# Altium schematic sheet V2_P1.schdoc
size 518 x 314 mm; Symbol: Sheet-Symbol_A4; Device: Sheet-Symbol_A4; @Project Name: rovi-controller; @Page Count: 1; @Update Date: 2024-12-15; @Create Date: 2024-11-28; @Schematic Name: Schematic2; @Page No: 1; @Page Name: P1; Company: EasyEDA.com; Reviewed: EasyEDA; Version: V0.1; Page Size: A4; Part Number: JLCPCB-002; Drawn: EasyEDA; @Board Name: Board2; @Create Time: 08:21:59; @Update Time: 13:14:34; Width: 2000; Height: 1200; Region Start: 1; X Region Count: 6; Y Region Count: 4; Blade Width: 10; Title Block Position: 3
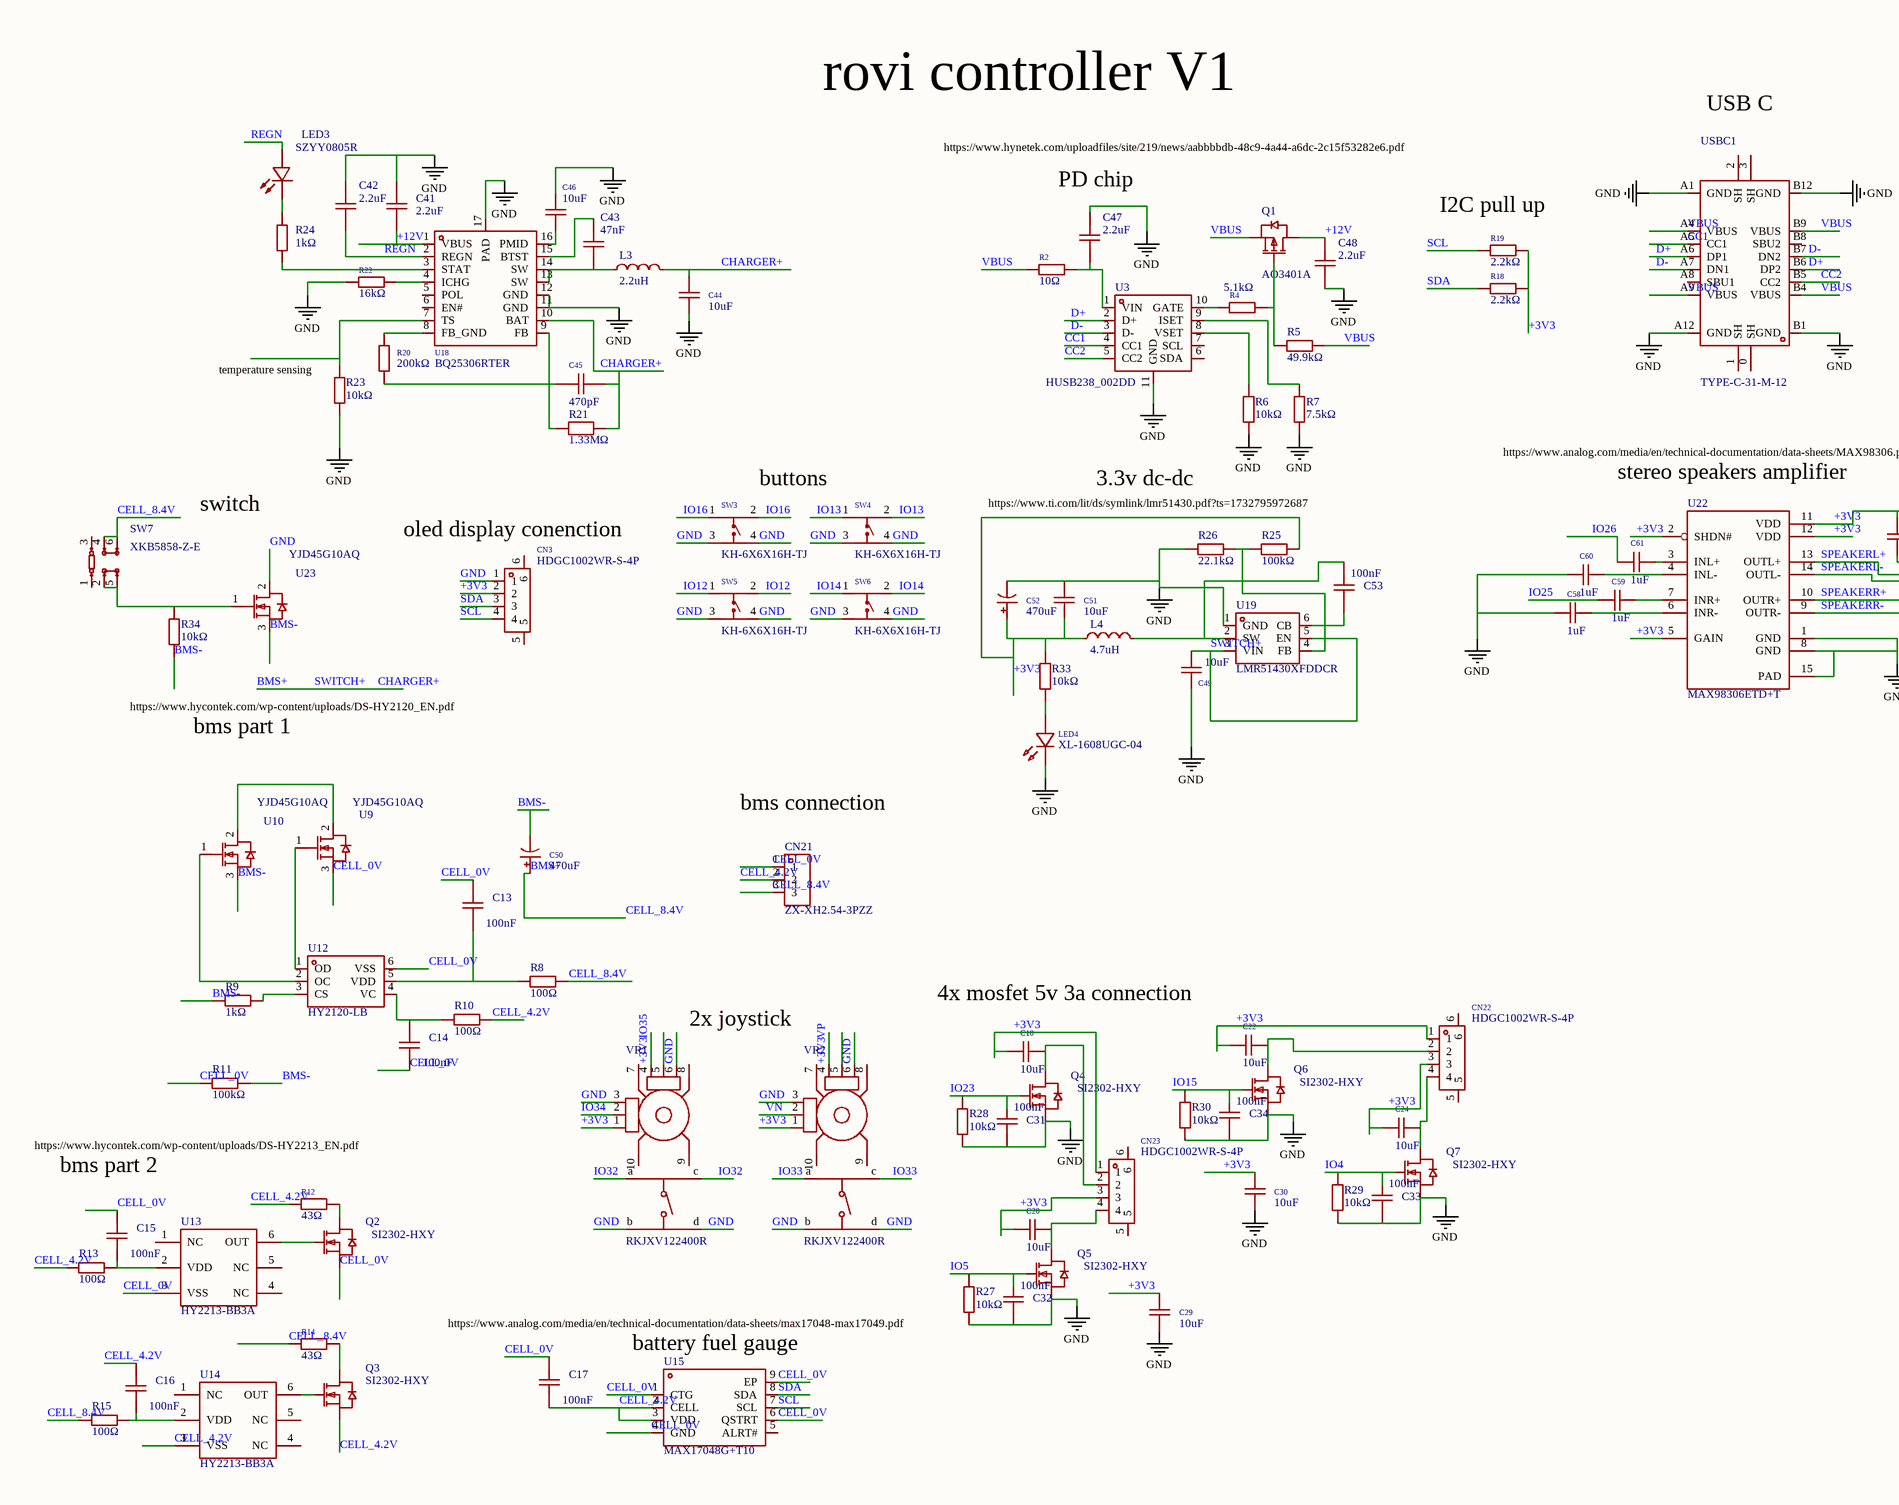
[diagram p0: V2_P1.schdoc, left]
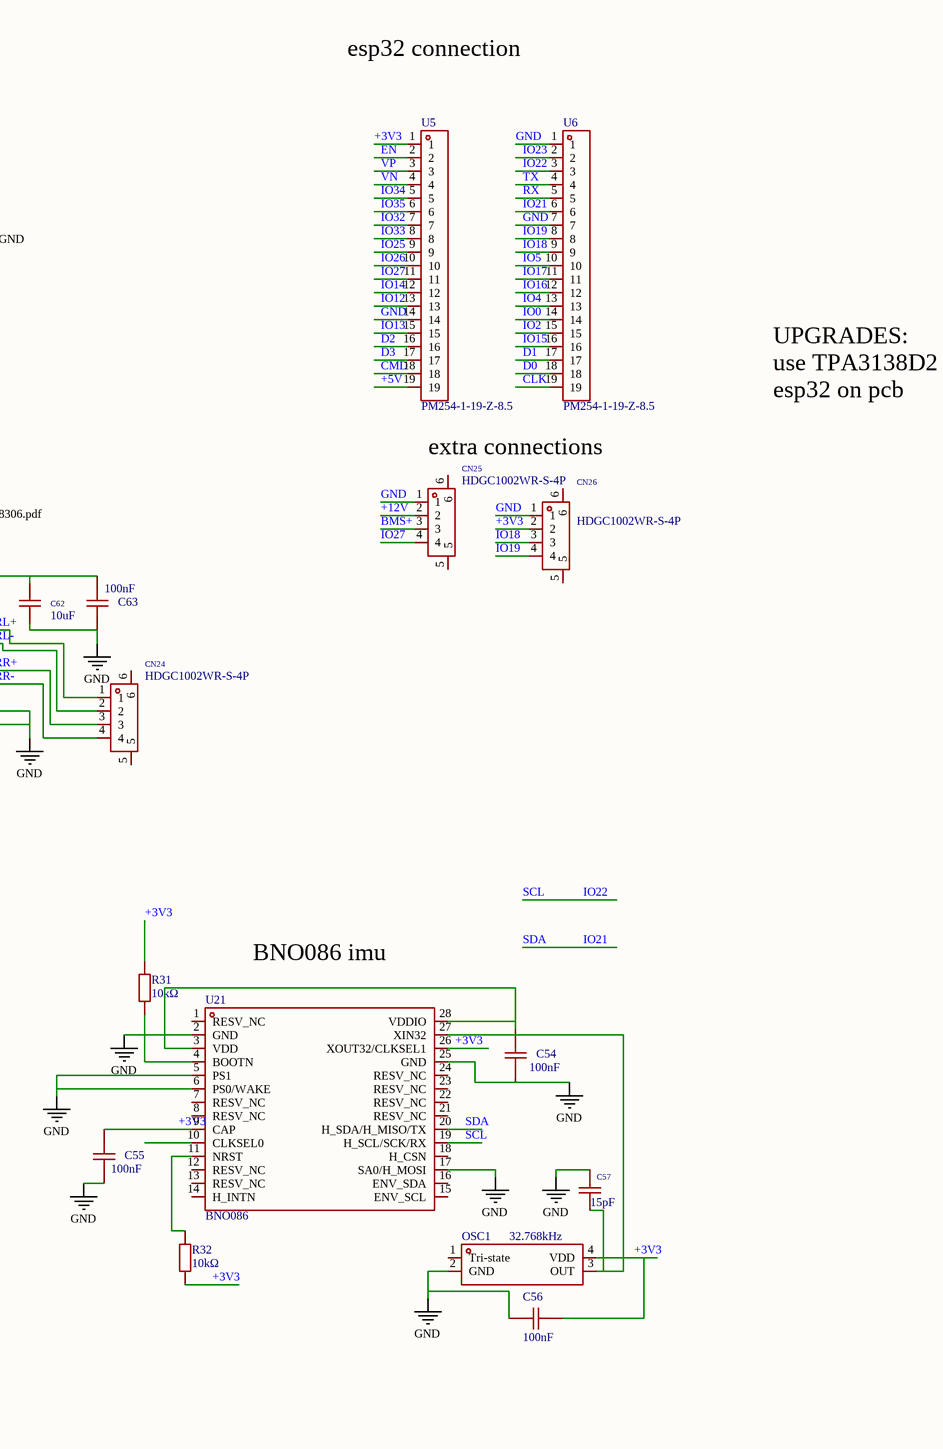
[diagram p1: V2_P1.schdoc, right]

## Parts
C13  100nF  [C0402]
C14  100nF  [C0402]
C15  100nF  [C0402]
C16  100nF  [C0402]
C17  100nF  [C0402]
C18  10uF  [C0805]
C20  10uF  [C0805]
C22  10uF  [C0805]
C24  10uF  [C0805]
C29  10uF  [C0805]
C30  10uF  [C0805]
C31  100nF  [C0402]
C32  100nF  [C0402]
C33  100nF  [C0402]
C34  100nF  [C0402]
C41  2.2uF  [C0603]
C42  2.2uF  [C0603]
C43  47nF  [C0402]
C44  10uF  [C0805]
C45  470pF  [C0402]
C46  10uF  [C0805]
C47  2.2uF  [C0603]
C48  2.2uF  [C0603]
C49  10uF  [C0805]
C50  470uF  [CAP-TH_BD8.0-P3.50-D0.6-FD]
C51  10uF  [C0805]
C52  470uF  [CAP-TH_BD8.0-P3.50-D0.6-FD]
C53  100nF  [C0402]
C54  100nF  [C0402]
C55  100nF  [C0402]
C56  100nF  [C0402]
C57  15pF  [C0402]
C58  1uF  [C0402]
C59  1uF  [C0402]
C60  1uF  [C0402]
C61  1uF  [C0402]
C62  10uF  [C0805]
C63  100nF  [C0402]
CN3  HDGC1002WR-S-4P  [CONN-SMD_4P-P1.00_HDGC_HDGC1002WR-S-4P]
CN21  ZX-XH2.54-3PZZ  [CONN-TH_3P-P2.54_2501S-3P]
CN22  HDGC1002WR-S-4P  [CONN-SMD_4P-P1.00_HDGC_HDGC1002WR-S-4P]
CN23  HDGC1002WR-S-4P  [CONN-SMD_4P-P1.00_HDGC_HDGC1002WR-S-4P]
CN24  HDGC1002WR-S-4P  [CONN-SMD_4P-P1.00_HDGC_HDGC1002WR-S-4P]
CN25  HDGC1002WR-S-4P  [CONN-SMD_4P-P1.00_HDGC_HDGC1002WR-S-4P]
CN26  HDGC1002WR-S-4P  [CONN-SMD_4P-P1.00_HDGC_HDGC1002WR-S-4P]
L3  2.2uH  [IND-SMD_L4.4-W4.2]
L4  4.7uH  [IND-SMD_L5.4-W5.2_FXL0530]
LED3  SZYY0805R  [LED0805-R-RD]
LED4  XL-1608UGC-04  [LED0603-RD_GREEN]
OSC1  32.768kHz  [OSC-SMD_4P-L3.2-W2.5-BL_TG-5006CE]
Q1  AO3401A  [SOT-23_L2.9-W1.3-P1.90-LS2.4-BR]
Q2  SI2302-HXY  [SOT-23-3_L2.9-W1.3-P1.90-LS2.4-BR]
Q3  SI2302-HXY  [SOT-23-3_L2.9-W1.3-P1.90-LS2.4-BR]
Q4  SI2302-HXY  [SOT-23-3_L2.9-W1.3-P1.90-LS2.4-BR]
Q5  SI2302-HXY  [SOT-23-3_L2.9-W1.3-P1.90-LS2.4-BR]
Q6  SI2302-HXY  [SOT-23-3_L2.9-W1.3-P1.90-LS2.4-BR]
Q7  SI2302-HXY  [SOT-23-3_L2.9-W1.3-P1.90-LS2.4-BR]
R2  10Ω  [R0402]
R4  5.1kΩ  [R0402]
R5  49.9kΩ  [R0402]
R6  10kΩ  [R0402]
R7  7.5kΩ  [R0402]
R8  100Ω  [R0603]
R9  1kΩ  [R0603]
R10  100Ω  [R0603]
R11  100kΩ  [R0603]
R12  43Ω  [R2512]
R13  100Ω  [R0603]
R14  43Ω  [R2512]
R15  100Ω  [R0603]
R18  2.2kΩ  [R0402]
R19  2.2kΩ  [R0402]
R20  200kΩ  [R0402]
R21  1.33MΩ  [R0402]
R22  16kΩ  [R0402]
R23  10kΩ  [R0402]
R24  1kΩ  [R0805]
R25  100kΩ  [R0603]
R26  22.1kΩ  [R0402]
R27  10kΩ  [R0402]
R28  10kΩ  [R0402]
R29  10kΩ  [R0402]
R30  10kΩ  [R0402]
R31  10kΩ  [R0402]
R32  10kΩ  [R0402]
R33  10kΩ  [R0402]
R34  10kΩ  [R0402]
SW3  KH-6X6X16H-TJ  [SW-TH_4P-L6.0-W6.0-P4.50-LS6.5]
SW4  KH-6X6X16H-TJ  [SW-TH_4P-L6.0-W6.0-P4.50-LS6.5]
SW5  KH-6X6X16H-TJ  [SW-TH_4P-L6.0-W6.0-P4.50-LS6.5]
SW6  KH-6X6X16H-TJ  [SW-TH_4P-L6.0-W6.0-P4.50-LS6.5]
SW7  XKB5858-Z-E  [SW-TH_XKB5858-Z-E]
U3  HUSB238_002DD  [DFN-10_L3.0-W3.0-P0.50-BL-EP2.5]
U5  PM254-1-19-Z-8.5  [HDR-TH_19P-P2.54-V-F]
U6  PM254-1-19-Z-8.5  [HDR-TH_19P-P2.54-V-F]
U9  YJD45G10AQ  [TO-252-2_L6.6-W6.1-P4.57-LS10.1-BR-CW]
U10  YJD45G10AQ  [TO-252-2_L6.6-W6.1-P4.57-LS10.1-BR-CW]
U12  HY2120-LB  [SOT-23-6_L2.9-W1.6-P0.95-LS2.8-BR]
U13  HY2213-BB3A  [SOT-23-6_L2.9-W1.6-P0.95-LS2.8-BR]
U14  HY2213-BB3A  [SOT-23-6_L2.9-W1.6-P0.95-LS2.8-BR]
U15  MAX17048G+T10  [DFN-8_L2.0-W2.0-P0.50-BL-EP]
U18  BQ25306RTER  [TQFN-16_L3.0-W3.0-P0.50-BL-EP1.7]
U19  LMR51430XFDDCR  [TSOT-23-6_L2.9-W1.6-P0.95-LS2.8-TL]
U21  BNO086  [LGA-28_L5.2-W3.8-P0.50-BL]
U22  MAX98306ETD+T  [TDFN-14_L3.0-W3.0-P0.40-BL-EP]
U23  YJD45G10AQ  [TO-252-2_L6.6-W6.1-P4.57-LS10.1-BR-CW]
USBC1  TYPE-C-31-M-12  [USB-C_SMD-TYPE-C-31-M-12]
VR1  RKJXV122400R  [SW-TH_RKJXV1224005]
VR2  RKJXV122400R  [SW-TH_RKJXV1224005]

## Nets
GND: C29.2 C30.2 C31.1 C32.1 C33.1 C34.1 C41.2 C42.2 C44.2 C46.1 C47.2 C48.1 C49.1 C51.2 C52.2 C54.1 C55.1 C56.2 C57.2 C58.1 C60.1 C62.1 C63.1 CN3.1 CN25.1 CN26.1 LED4.1(K) OSC1.2(GND) Q4.2(S) Q5.2(S) Q6.2(S) Q7.2(S) R6.2 R7.1 R22.1 R23.2 R26.1 R27.2 R28.2 R29.2 R30.2 SW3.3 SW3.4 SW4.3 SW4.4 SW5.3 SW5.4 SW6.3 SW6.4 U3.11(GND) U5.14 U6.1 U6.7 U18.11(GND) U18.12(GND) U18.17(PAD) U19.1(GND) U21.2(GND) U21.5(PS1) U21.6(PS0/WAKE) U21.17(SA0/H_MOSI) U21.25(GND) U22.1(GND) U22.8(GND) U22.15(PAD) U23.2(D) USBC1.A1(GND) USBC1.A12(GND) USBC1.B1(GND) USBC1.B12(GND) VR1.3(A) VR1.6(B) VR1.b VR1.d VR2.3(A) VR2.6(B) VR2.b VR2.d
+3V3: C18.2 C20.2 C22.2 C24.2 C29.1 C30.1 C51.1 C52.1 C55.2 C56.1 C62.2 C63.2 CN3.2 CN22.1 CN22.3 CN23.1 CN23.3 CN26.2 L4.1 OSC1.4(VDD) R18.2 R19.2 R25.2 R31.1 R32.2 R33.1 U5.1 U5.3 U5.6 U21.9(CAP) U21.26(XOUT32/CLKSEL1) U22.2(SHDN#) U22.5(GAIN) U22.11(VDD) U22.12(VDD) VR1.1(B) VR1.4(A) VR2.1(B) VR2.4(A)  [also labelled IO35, VP]
+5V: U5.19
+12V: C41.1 C48.2 CN25.2 Q1.3(D) U18.1(VBUS)
BMS+: C44.1 C45.2 C49.2 C50.1 CN21.3 CN25.3 L3.2 R8.2 R14.1 R15.1 R21.2 SW7.4 SW7.6 U18.10(BAT) U19.3(VIN) U19.5(EN)  [also labelled CELL_8.4V, CHARGER+, SWITCH+]
BMS-: C50.2 R9.1 R11.2 R34.2 U10.3(S) U23.3(S)
CC1: U3.4(CC1) USBC1.A5(CC1)
CC2: U3.5(CC2) USBC1.B5(CC2)
CELL_0V: C13.2 C14.1 C15.2 C17.2 CN21.1 Q2.2(S) R11.1 U9.3(S) U12.6(VSS) U13.3(VSS) U15.1(CTG) U15.4(GND) U15.6(QSTRT) U15.9(EP)
CELL_4.2V: C16.2 C17.1 CN21.2 Q3.2(S) R10.2 R12.1 R13.1 U14.3(VSS) U15.2(CELL) U15.3(VDD)
CLK: U6.19
CMD: U5.18
D0: U6.18
D1: U6.17
D2: U5.16
D3: U5.17
D+: U3.2(D+) USBC1.A6(DP1) USBC1.B6(DP2)
D-: U3.3(D-) USBC1.A7(DN1) USBC1.B7(DN2)
EN: U5.2
IO0: U6.14
IO2: U6.15
IO4: C33.2 Q7.1(G) R29.1 U6.13
IO5: C32.2 Q5.1(G) R27.1 U6.10
IO12: SW5.1 SW5.2 U5.13
IO13: SW4.1 SW4.2 U5.15
IO14: SW6.1 SW6.2 U5.12
IO15: C34.2 Q6.1(G) R30.1 U6.16
IO16: SW3.1 SW3.2 U6.12
IO17: U6.11
IO18: CN26.3 U6.9
IO19: CN26.4 U6.8
IO21: CN3.3 R18.1 U6.6 U15.8(SDA) U21.20(H_SDA/H_MISO/TX)  [also labelled SDA]
IO22: CN3.4 R19.1 U6.3 U15.7(SCL) U21.19(H_SCL/SCK/RX)  [also labelled SCL]
IO23: C31.2 Q4.1(G) R28.1 U6.2
IO25: C59.1 U5.9
IO26: C61.1 U5.10
IO27: CN25.4 U5.11
IO32: U5.7 VR1.a VR1.c
IO33: U5.8 VR2.a VR2.c
IO34: U5.5 VR1.2(DTA)
REGN: C42.1 LED3.1(+) U18.2(REGN)
RX: U6.5
SPEAKERL+: CN24.1 U22.13(OUTL+)
SPEAKERL-: CN24.2 U22.14(OUTL-)
SPEAKERR+: CN24.3 U22.10(OUTR+)
SPEAKERR-: CN24.4 U22.9(OUTR-)
TX: U6.4
VBUS: Q1.2(S) R2.2 R5.1 USBC1.A4(VBUS) USBC1.A9(VBUS) USBC1.B4(VBUS) USBC1.B9(VBUS)
VN: U5.4 VR2.2(DTA)
NetC13_1: C13.1 R8.1 U12.5(VDD)
NetC14_2: C14.2 R10.1 U12.4(VC)
NetC15_1: C15.1 R13.2 U13.2(VDD)
NetC16_1: C16.1 R15.2 U14.2(VDD)
NetC18_1: C18.1 CN23.2 Q4.3(D)
NetC20_1: C20.1 CN23.4 Q5.3(D)
NetC22_1: C22.1 CN22.2 Q6.3(D)
NetC24_1: C24.1 CN22.4 Q7.3(D)
NetC43_1: C43.1 L3.1 U18.13(SW) U18.14(SW)
NetC43_2: C43.2 U18.15(BTST)
NetC45_1: C45.1 R20.1 R21.1 U18.9(FB)
NetC46_2: C46.2 U18.16(PMID)
NetC47_1: C47.1 R2.1 U3.1(VIN)
NetC53_1: C53.1 U19.6(CB)
NetC53_2: C53.2 L4.2 U19.2(SW)
NetC54_2: C54.2 U21.3(VDD) U21.28(VDDIO)
NetC57_1: C57.1 OSC1.3(OUT) U21.27(XIN32)
NetC58_2: C58.2 U22.6(INR-)
NetC59_2: C59.2 U22.7(INR+)
NetC60_2: C60.2 U22.4(INL-)
NetC61_2: C61.2 U22.3(INL+)
NetLED3_2: LED3.2(-) R24.2
NetLED4_2: LED4.2(A) R33.2
NetQ1_1: Q1.1(G) R4.1 R5.2
NetQ2_1: Q2.1(G) U13.6(OUT)
NetQ2_3: Q2.3(D) R12.2
NetQ3_1: Q3.1(G) U14.6(OUT)
NetQ3_3: Q3.3(D) R14.2
NetR4_2: R4.2 U3.10(GATE)
NetR6_1: R6.1 U3.8(VSET)
NetR7_2: R7.2 U3.9(ISET)
NetR9_2: R9.2 U12.3(CS)
NetR20_2: R20.2 U18.8(FB_GND)
NetR22_2: R22.2 U18.4(ICHG)
NetR23_1: R23.1 U18.7(TS)
NetR24_1: R24.1 U18.3(STAT)
NetR25_1: R25.1 R26.2 U19.4(FB)
NetR31_2: R31.2 U21.4(BOOTN)
NetR32_1: R32.1 U21.11(NRST)
NetR34_1: R34.1 SW7.2 SW7.5 U23.1(G)
NetU9_1: U9.1(G) U12.1(OD)
NetU9_2: U9.2(D) U10.2(D)
NetU10_1: U10.1(G) U12.2(OC)

Not connected (* = marked no-connect by the designer): CN3 5 6; CN22 5 6; CN23 5 6; CN24 5 6; CN25 5 6; CN26 5 6; OSC1 1(Tri-state); SW7 1 3; U3 6(SDA) 7(SCL); U13 1(NC) 4(NC) 5(NC); U14 1(NC) 4(NC) 5(NC); U15 5(ALRT#); U18 5(POL) 6(EN#); U21 1(RESV_NC) 7(RESV_NC) 8(RESV_NC) 10(CLKSEL0) 12(RESV_NC) 13(RESV_NC) 14(H_INTN) 15(ENV_SCL) 16(ENV_SDA) 18(H_CSN) 21(RESV_NC) 22(RESV_NC) 23(RESV_NC) 24(RESV_NC); USBC1 0(SH) 1(SH) 2(SH) 3(SH) A8(SBU1) B8(SBU2); VR1 5(DTA) 7(GND) 8(GND) 9(GND) 10(GND); VR2 5(DTA) 7(GND) 8(GND) 9(GND) 10(GND)

## Notes on the sheet
- esp32 connection
- rovi controller V1
- USB C
- https://www.hynetek.com/uploadfiles/site/219/news/aabbbbdb-48c9-4a44-a6dc-2c15f53282e6.pdf
- (near C47) PD chip
- (near R19) I2C pull up
- UPGRADES:
  use TPA3138D2 as audio
  esp32 on pcb
- (near R23) temperature sensing
- extra connections
- https://www.analog.com/media/en/technical-documentation/data-sheets/MAX98306.pdf
- switch
- buttons
- https://www.ti.com/lit/ds/symlink/lmr51430.pdf?ts=1732795972687
- 3.3v dc-dc
- stereo speakers amplifier
- (near CN3) oled display conenction
- https://www.hycontek.com/wp-content/uploads/DS-HY2120_EN.pdf
- bms part 1
- bms connection
- BNO086 imu
- 2x joystick
- 4x mosfet 5v 3a connection
- https://www.hycontek.com/wp-content/uploads/DS-HY2213_EN.pdf
- bms part 2
- (near R27) https://www.analog.com/media/en/technical-documentation/data-sheets/max17048-max17049.pdf
- (near U15) battery fuel gauge
- 1
- 2
- 3
- 4
- 5
- 6
- A
- B
- C
- Schematic
- Schematic2
- Create Date
- Update Date
- 2024-12-15
- 2024-11-28
- D
- Drawn
- Page
- EasyEDA
- P1
- Part Number
- JLCPCB-002
- Reviewed
- VER
- SIZE
- PAGE
- rovi-controller
- OF
- V0.1
- A4
- EasyEDA.com

## Library data of the parts
C13-C17 C31-C34 C53-C56 C63 = CL05B104KO5NNNC: Manufacturer: SAMSUNG(三星); Add into BOM: yes; Tolerance: ±10%; Symbol: CL05B104KO5NNNC; Device: CL05B104KO5NNNC; LCSC Part Name: 100nF ±10% 16V; Supplier Part: C1525; Manufacturer Part: CL05B104KO5NNNC; Supplier Footprint: 0402; JLCPCB Part Class: Basic Part; Datasheet: https://atta.szlcsc.com/upload/public/pdf/source/20160218/1457707763339.pdf; Supplier: LCSC; Convert to PCB: yes; Value: 100nF
C18 C20 C22 C24 C29 C30 C44 C46 C49 C51 C62 = CL21A106KOQNNNE: Manufacturer: SAMSUNG(三星); Add into BOM: yes; Tolerance: ±10%; Symbol: CL21A106KOQNNNE; Device: CL21A106KOQNNNE; Supplier: LCSC; Manufacturer Part: CL21A106KOQNNNE; Value: 10uF; Supplier Part: C1713; JLCPCB Part Class: Extended Part; LCSC Part Name: 10uF ±10% 16V; Supplier Footprint: 0805; Datasheet: https://atta.szlcsc.com/upload/public/pdf/source/20160218/1457707763339.pdf; Convert to PCB: yes
C41 C42 C47 C48 = CL10A225KA8NNNC: Manufacturer: SAMSUNG(三星); Add into BOM: yes; Tolerance: ±10%; Symbol: CL10A225KA8NNNC; Device: CL10A225KA8NNNC; LCSC Part Name: 2.2uF ±10% 25V; Supplier Part: C57895; Manufacturer Part: CL10A225KA8NNNC; Supplier Footprint: 0603; JLCPCB Part Class: Extended Part; Datasheet: https://atta.szlcsc.com/upload/public/pdf/source/20160218/1457707763339.pdf; Supplier: LCSC; Convert to PCB: yes; Value: 2.2uF
C43 = 0402B473K250NT: Manufacturer: FH(风华); Add into BOM: yes; Tolerance: ±10%; Symbol: 0402B473K250NT; Device: 0402B473K250NT; LCSC Part Name: 47nF ±10% 25V; Supplier Part: C285062; Manufacturer Part: 0402B473K250NT; Supplier Footprint: 0402; JLCPCB Part Class: Extended Part; Datasheet: https://atta.szlcsc.com/upload/public/pdf/source/20200305/C486355_26A10D38EF8C2A5C37091D0039909270.pdf; Supplier: LCSC; Convert to PCB: yes; Value: 47nF
C45 = CC0402KRX7R9BB471: Manufacturer: YAGEO(国巨); Add into BOM: yes; Tolerance: ±10%; Symbol: CC0402KRX7R9BB471; Device: CC0402KRX7R9BB471; Supplier: LCSC; Manufacturer Part: CC0402KRX7R9BB471; Value: 470pF; Supplier Part: C106207; JLCPCB Part Class: Extended Part; LCSC Part Name: 470pF ±10% 50V; Supplier Footprint: 0402; Datasheet: https://atta.szlcsc.com/upload/public/pdf/source/20181008/C309510_22F155564471FAF6A489F7D68F34234E.pdf; Convert to PCB: yes
C50 C52 = KM477M016F12RR0VH2FP0: Manufacturer: CX(承兴); Symbol: 470uf16v; Add into BOM: yes; Tolerance: ±20%; Lifetime @ Temp: 2000hrs@105℃; Device: KM477M016F12RR0VH2FP0; Supplier: LCSC; Manufacturer Part: KM477M016F12RR0VH2FP0; Value: 470uF; Supplier Part: C28067; JLCPCB Part Class: Extended Part; LCSC Part Name: 470uF ±20% 16V; Supplier Footprint: 插件,D8xL12mm; Datasheet: https://atta.szlcsc.com/upload/public/pdf/source/20211027/06D6BA3719C264B639DC286D935D03EA.pdf; Convert to PCB: yes
C57 = CC0402JRNPO9BN150: Manufacturer: YAGEO(国巨); Add into BOM: yes; Tolerance: ±5%; Symbol: CC0402JRNPO9BN150; Device: CC0402JRNPO9BN150; Supplier: LCSC; Manufacturer Part: CC0402JRNPO9BN150; Value: 15pF; Supplier Part: C106997; JLCPCB Part Class: Extended Part; LCSC Part Name: 15pF ±5% 50V; Supplier Footprint: 0402; Datasheet: https://atta.szlcsc.com/upload/public/pdf/source/20170914/C128857_1505359892143968080.pdf; Convert to PCB: yes
C58-C61 = CL05A105KP5NNNC: Manufacturer: SAMSUNG(三星); Add into BOM: yes; Tolerance: ±10%; Symbol: CL05A105KP5NNNC; Device: CL05A105KP5NNNC; Supplier: LCSC; Manufacturer Part: CL05A105KP5NNNC; Value: 1uF; Supplier Part: C14445; JLCPCB Part Class: Extended Part; LCSC Part Name: 1uF ±10% 10V; Supplier Footprint: 0402; Datasheet: https://atta.szlcsc.com/upload/public/pdf/source/20160218/1457707763339.pdf; Convert to PCB: yes
CN3 CN22-CN26 = HDGC1002WR-S-4P: Manufacturer: HDGC(华德共创); Add into BOM: yes; Pins Structure: 1x4P; Pitch: 1mm; Reference Series: SH; Number of PINs Per Row: 4; Current Rating (Max): 1A; Symbol: HDGC1002WR-S-4P; Device: HDGC1002WR-S-4P; Supplier: LCSC; Supplier Part: C2936214; Manufacturer Part: HDGC1002WR-S-4P; JLCPCB Part Class: Extended Part; LCSC Part Name: 1x4P 间距:1mm 卧贴; Supplier Footprint: SMD,P=1mm,卧贴; Datasheet: https://atta.szlcsc.com/upload/public/pdf/source/20211229/E8A09E85670B5E97244D2008A24D97FE.pdf; Convert to PCB: yes; Mounting Style: 卧贴; Number of Pins: 4P; Number of Rows: 1; Row Spacing: -; Operating Temperature Range: -25℃~+70℃
CN21 = ZX-XH2.54-3PZZ: Manufacturer: Megastar(兆星); Add into BOM: yes; Pins Structure: 1x3P; Pitch: 2.54mm; Reference Series: XH; Number of PINs Per Row: 3; Current Rating (Max): 3A; Symbol: ZX-XH2.54-3PZZ; Device: ZX-XH2.54-3PZZ; LCSC Part Name: ZX-XH2.54-3PZZ; Supplier Part: C7429633; Manufacturer Part: ZX-XH2.54-3PZZ; Supplier Footprint: 插件,P=2.54mm; JLCPCB Part Class: Extended Part; Datasheet: https://atta.szlcsc.com/upload/public/pdf/source/20230619/AE17037A2CFDBE8D9CBA775D61AD0A84.pdf; Supplier: LCSC; Convert to PCB: yes; Mounting Style: Straight; Number of Pins: 3P; Number of Rows: 1; Row Spacing: -; Contact Material: Brass; Contact Plating: Tin; Operating Temperature Range: -25℃~+85℃
L3 = FXL0420-2R2-M: Manufacturer: cjiang(长江微电); Add into BOM: yes; Tolerance: ±20%; Saturation Current (Isat): 5A; Type: Integrated molded inductor; Symbol: FXL0420-2R2-M; Device: FXL0420-2R2-M; LCSC Part Name: 2.2uH ±20% 5A; Supplier Part: C167206; Manufacturer Part: FXL0420-2R2-M; Supplier Footprint: SMD,4.2x4.4mm; JLCPCB Part Class: Extended Part; Datasheet: https://atta.szlcsc.com/upload/public/pdf/source/20240426/3189EA8206330E2108542F9E34E540E7.pdf; Supplier: LCSC; Convert to PCB: yes; Value: 2.2uH
L4 = FXL0530-4R7-M: Manufacturer: cjiang(长江微电); Add into BOM: yes; Tolerance: ±20%; Saturation Current (Isat): 5A; Type: Integrated molded inductor; Symbol: FXL0530-4R7-M; Device: FXL0530-4R7-M; LCSC Part Name: 4.7uH ±20% 5A; Supplier Part: C177246; Manufacturer Part: FXL0530-4R7-M; Supplier Footprint: SMD,5.2x5.4mm; JLCPCB Part Class: Extended Part; Datasheet: https://atta.szlcsc.com/upload/public/pdf/source/20240426/3189EA8206330E2108542F9E34E540E7.pdf; Supplier: LCSC; Convert to PCB: yes; Value: 4.7uH
LED3 = SZYY0805R: Manufacturer: yongyu(永裕光电); Add into BOM: yes; Emitted Color: Red; Power Dissipation: 40mW; Forward Current: 10mA; Dominant Wavelength: 615nm~630nm; Peak Wavelength: 645nm; Lens Color: 无色透明透镜; Viewing Angle: 120°; Symbol: SZYY0805R; Device: SZYY0805R; LCSC Part Name: 红灯; Supplier Part: C434431; Manufacturer Part: SZYY0805R; Supplier Footprint: 0805; JLCPCB Part Class: Extended Part; Datasheet: https://atta.szlcsc.com/upload/public/pdf/source/20191204/C434431_431C171B758FE4C37FA40B1B295AA7AB.pdf; Supplier: LCSC; Convert to PCB: yes; Diode Configuration: -; Color Temperature: -; Mounting Sytle: -; Operating Temperature: -40℃~+85℃
LED4 = XL-1608UGC-04: Manufacturer: XINGLIGHT(成兴光); Add into BOM: yes; Emitted Color: Emerald; Power Dissipation: 80mW; Forward Current: 25mA; Dominant Wavelength: 516nm~525nm; Peak Wavelength: 534nm; Diode Configuration: 独立二极管; Lens Color: 无色透明透镜; Viewing Angle: 120°; Mounting Sytle: Positive post; Symbol: XL-1608UGC-04; Device: XL-1608UGC-04; Supplier: LCSC; Supplier Part: C965804; Manufacturer Part: XL-1608UGC-04; JLCPCB Part Class: Extended Part; LCSC Part Name: XL-1608UGC-04; Supplier Footprint: 0603; Datasheet: https://atta.szlcsc.com/upload/public/pdf/source/20221102/520D6E465E5CFD1609C8A4DBC80D4018.pdf; Convert to PCB: yes; Lamp Holder Type: -; Forward Voltage (VF): -; Color Temperature: -; Luminous Intensity: -; Operating Temperature: -30℃~+85℃
OSC1 = OK2EL89CJI-111YLC-32.768K: Manufacturer: YXC(扬兴晶振); Add into BOM: yes; Normal temperature Frequency Tolerance: ±10ppm; Supply Voltage: 1.8V~3.3V; Symbol: OK2EL89CJI-111YLC-32.768K; Device: OK2EL89CJI-111YLC-32.768K; LCSC Part Name: 32.768KHZ 1.8V-3.3V ±10PPM YSO120TK; Supplier Part: C5280579; Manufacturer Part: OK2EL89CJI-111YLC-32.768K; Supplier Footprint: SMD3225-4P; JLCPCB Part Class: Extended Part; Datasheet: https://atta.szlcsc.com/upload/public/pdf/source/20221123/314DEFB66F8D0824EF78ADB5B539B6E4.pdf; Supplier: LCSC; Convert to PCB: yes; Value: 32.768kHz
Q1 = AO3401A_C347476: Manufacturer: UMW(友台半导体); Add into BOM: yes; Type: 1个PChannel; Gate Threshold Voltage (Vgs(th)@Id): 1.3V@250uA; Total Gate Charge (Qg@Vgs): 9.4nC@4.5V; Input Capacitance (Ciss@Vds): 954pF@15V; Symbol: AO3401A_C347476; Device: AO3401A_C347476; LCSC Part Name: 1个P沟道 耐压:30V 电流:4.2A; Supplier Part: C347476; Manufacturer Part: AO3401A; Supplier Footprint: SOT-23; JLCPCB Part Class: Extended Part; Datasheet: https://atta.szlcsc.com/upload/public/pdf/source/20231109/42F312EBB081D72F04A7E8221BFFAF9D.pdf; Supplier: LCSC; Convert to PCB: yes; Reverse Transfer Capacitance (Crss@Vds): -; Operating Temperature: -
Q2-Q7 = SI2302-HXY: Manufacturer: HXY MOSFET(华轩阳电子); Symbol: SI2302_C4748714; Add into BOM: yes; Type: 1个NChannel; Power Dissipation (Pd): 900mW; Drain Source On Resistance (RDS(on)@Vgs,Id): 55mΩ@4.5V,2.8A; Gate Threshold Voltage (Vgs(th)@Id): 1.2V@250uA; Input Capacitance (Ciss@Vds): 260pF@10V; Device: SI2302-HXY; LCSC Part Name: 1个N沟道 耐压:20V 电流:2.8A; Supplier Part: C4748714; Manufacturer Part: SI2302-HXY; Supplier Footprint: SOT-23; JLCPCB Part Class: Extended Part; Datasheet: https://atta.szlcsc.com/upload/public/pdf/source/20220720/B2EC63D46AD65363D9D3692163B46869.pdf; Supplier: LCSC; Convert to PCB: yes
R2 = 0402WGF100JTCE: Manufacturer: UNI-ROYAL(厚声); Add into BOM: yes; Tolerance: ±1%; Temperature Coefficient: ±200ppm/℃; Symbol: 0402WGF100JTCE; Device: 0402WGF100JTCE; Supplier: LCSC; Manufacturer Part: 0402WGF100JTCE; Supplier Part: C25077; Value: 10Ω; JLCPCB Part Class: Basic Part; LCSC Part Name: 10Ω ±1% 62.5mW 厚膜电阻; Supplier Footprint: 0402; Datasheet: https://atta.szlcsc.com/upload/public/pdf/source/20200306/C422600_1E6D84923E4A46A82E41ADD87F860B5C.pdf; Convert to PCB: yes; Type: Thick Film Resistors; Operating Temperature Range: -55℃~+155℃
R4 = 0402WGF5101TCE: Manufacturer: UNI-ROYAL(厚声); Add into BOM: yes; Tolerance: ±1%; Temperature Coefficient: ±100ppm/℃; Symbol: 0402WGF5101TCE; Device: 0402WGF5101TCE; Supplier: LCSC; Manufacturer Part: 0402WGF5101TCE; Supplier Part: C25905; Value: 5.1kΩ; JLCPCB Part Class: Basic Part; LCSC Part Name: 5.1kΩ ±1% 62.5mW 厚膜电阻; Supplier Footprint: 0402; Datasheet: https://atta.szlcsc.com/upload/public/pdf/source/20200306/C422600_1E6D84923E4A46A82E41ADD87F860B5C.pdf; Convert to PCB: yes; Type: Thick Film Resistors; Operating Temperature Range: -55℃~+155℃
R5 = 0402WGF4992TCE: Manufacturer: UNI-ROYAL(厚声); Add into BOM: yes; Tolerance: ±1%; Temperature Coefficient: ±100ppm/℃; Symbol: 0402WGF4992TCE; Device: 0402WGF4992TCE; LCSC Part Name: 49.9kΩ ±1% 62.5mW 厚膜电阻; Supplier Part: C25897; Manufacturer Part: 0402WGF4992TCE; Supplier Footprint: 0402; JLCPCB Part Class: Extended Part; Datasheet: https://atta.szlcsc.com/upload/public/pdf/source/20200306/C422600_1E6D84923E4A46A82E41ADD87F860B5C.pdf; Supplier: LCSC; Convert to PCB: yes; Type: Thick Film Resistors; Value: 49.9kΩ; Operating Temperature Range: -55℃~+155℃
R6 R23 R27-R34 = 0402WGF1002TCE: Manufacturer: UNI-ROYAL(厚声); Add into BOM: yes; Tolerance: ±1%; Temperature Coefficient: ±100ppm/℃; Symbol: 0402WGF1002TCE; Device: 0402WGF1002TCE; LCSC Part Name: 10kΩ ±1% 62.5mW 厚膜电阻; Supplier Part: C25744; Manufacturer Part: 0402WGF1002TCE; Supplier Footprint: 0402; JLCPCB Part Class: Basic Part; Datasheet: https://atta.szlcsc.com/upload/public/pdf/source/20200306/C422600_1E6D84923E4A46A82E41ADD87F860B5C.pdf; Supplier: LCSC; Convert to PCB: yes; Type: Thick Film Resistors; Value: 10kΩ; Operating Temperature Range: -55℃~+155℃
R7 = RC0402FR-077K5L: Manufacturer: YAGEO(国巨); Add into BOM: yes; Tolerance: ±1%; Temperature Coefficient: ±100ppm/℃; Symbol: RC0402FR-077K5L; Device: RC0402FR-077K5L; LCSC Part Name: 厚膜电阻 7.5kΩ ±1% 62.5mW; Supplier Part: C137934; Manufacturer Part: RC0402FR-077K5L; Supplier Footprint: 0402; JLCPCB Part Class: Extended Part; Datasheet: https://atta.szlcsc.com/upload/public/pdf/source/20181009/C309620_DA5935B6E1D48212CB7A533FE518B3C2.pdf; Supplier: LCSC; Convert to PCB: yes; Type: Thick Film Resistors; Value: 7.5kΩ; Operating Temperature Range: -55℃~+155℃
R8 R10 R13 R15 = RS-03K1000FT: Manufacturer: FH(风华); Add into BOM: yes; Tolerance: ±1%; Temperature Coefficient: ±100ppm/℃; Symbol: RS-03K1000FT; Device: RS-03K1000FT; LCSC Part Name: 厚膜电阻 100Ω ±1% 100mW; Supplier Part: C115420; Manufacturer Part: RS-03K1000FT; Supplier Footprint: 0603; JLCPCB Part Class: Extended Part; Datasheet: https://atta.szlcsc.com/upload/public/pdf/source/20140616/1457707091974.pdf; Supplier: LCSC; Convert to PCB: yes; Type: Thick Film Resistors; Value: 100Ω; Operating Temperature Range: -55℃~+155℃
R9 = RS-03K1001FT: Manufacturer: FH(风华); Add into BOM: yes; Tolerance: ±1%; Temperature Coefficient: ±100ppm/℃; Symbol: RS-03K1001FT; Device: RS-03K1001FT; LCSC Part Name: 厚膜电阻 1kΩ ±1% 100mW; Supplier Part: C115325; Manufacturer Part: RS-03K1001FT; Supplier Footprint: 0603; JLCPCB Part Class: Extended Part; Datasheet: https://atta.szlcsc.com/upload/public/pdf/source/20140616/1457707091974.pdf; Supplier: LCSC; Convert to PCB: yes; Type: Thick Film Resistors; Value: 1kΩ; Operating Temperature Range: -55℃~+155℃
R11 R25 = RS-03K104JT: Manufacturer: FH(风华); Add into BOM: yes; Tolerance: ±5%; Temperature Coefficient: ±100ppm/℃; Symbol: RS-03K104JT; Device: RS-03K104JT; LCSC Part Name: 厚膜电阻 100kΩ ±5% 100mW; Supplier Part: C73806; Manufacturer Part: RS-03K104JT; Supplier Footprint: 0603; JLCPCB Part Class: Extended Part; Datasheet: https://atta.szlcsc.com/upload/public/pdf/source/20140616/1457707091974.pdf; Supplier: LCSC; Convert to PCB: yes; Type: Thick Film Resistors; Value: 100kΩ; Operating Temperature Range: -55℃~+155℃
R12 R14 = RTT25430JTE: Manufacturer: RALEC(旺诠); Add into BOM: yes; Tolerance: ±5%; Temperature Coefficient: ±100ppm/℃; Symbol: RTT25430JTE; Device: RTT25430JTE; Supplier: LCSC; Manufacturer Part: RTT25430JTE; Supplier Part: C105118; Value: 43Ω; JLCPCB Part Class: Extended Part; LCSC Part Name: 厚膜电阻 43Ω ±5% 1W; Supplier Footprint: 2512; Datasheet: https://atta.szlcsc.com/upload/public/pdf/source/20191219/C158410_884373A5B7E1BC76BF57BC45A946C093.pdf; Convert to PCB: yes; Type: Thick Film Resistors; Operating Temperature Range: -55℃~+155℃
R18 R19 = 0402WGF2201TCE: Manufacturer: UNI-ROYAL(厚声); Add into BOM: yes; Tolerance: ±1%; Temperature Coefficient: ±100ppm/℃; Symbol: 0402WGF2201TCE; Device: 0402WGF2201TCE; Supplier: LCSC; Manufacturer Part: 0402WGF2201TCE; Supplier Part: C25879; Value: 2.2kΩ; JLCPCB Part Class: Basic Part; LCSC Part Name: 2.2kΩ ±1% 62.5mW 厚膜电阻; Supplier Footprint: 0402; Datasheet: https://atta.szlcsc.com/upload/public/pdf/source/20200306/C422600_1E6D84923E4A46A82E41ADD87F860B5C.pdf; Convert to PCB: yes; Type: Thick Film Resistors; Operating Temperature Range: -55℃~+155℃
R20 = 0402WGF2003TCE: Manufacturer: UNI-ROYAL(厚声); Add into BOM: yes; Tolerance: ±1%; Temperature Coefficient: ±100ppm/℃; Symbol: 0402WGF2003TCE; Device: 0402WGF2003TCE; Supplier: LCSC; Manufacturer Part: 0402WGF2003TCE; Supplier Part: C25764; Value: 200kΩ; JLCPCB Part Class: Basic Part; LCSC Part Name: 200kΩ ±1% 62.5mW 厚膜电阻; Supplier Footprint: 0402; Datasheet: https://atta.szlcsc.com/upload/public/pdf/source/20200306/C422600_1E6D84923E4A46A82E41ADD87F860B5C.pdf; Convert to PCB: yes; Type: Thick Film Resistors; Operating Temperature Range: -55℃~+155℃
R21 = FRC0402F1334TS: Manufacturer: FOJAN(富捷); Add into BOM: yes; Tolerance: ±1%; Temperature Coefficient: ±100ppm/℃; Symbol: FRC0402F1334TS; Device: FRC0402F1334TS; LCSC Part Name: 1.33MΩ ±1% 62.5mW 厚膜电阻; Supplier Part: C5713265; Manufacturer Part: FRC0402F1334TS; Supplier Footprint: 0402; JLCPCB Part Class: Extended Part; Datasheet: https://atta.szlcsc.com/upload/public/pdf/source/20211221/925EC7D7225764EE0046F22065062C87.pdf; Supplier: LCSC; Convert to PCB: yes; Type: Thick Film Resistors; Value: 1.33MΩ
R22 = 0402WGF1602TCE: Manufacturer: UNI-ROYAL(厚声); Add into BOM: yes; Tolerance: ±1%; Temperature Coefficient: ±100ppm/℃; Symbol: 0402WGF1602TCE; Device: 0402WGF1602TCE; Supplier: LCSC; Manufacturer Part: 0402WGF1602TCE; Supplier Part: C25759; Value: 16kΩ; JLCPCB Part Class: Extended Part; LCSC Part Name: 16kΩ ±1% 62.5mW 厚膜电阻; Supplier Footprint: 0402; Datasheet: https://atta.szlcsc.com/upload/public/pdf/source/20200306/C422600_1E6D84923E4A46A82E41ADD87F860B5C.pdf; Convert to PCB: yes; Type: Thick Film Resistors; Operating Temperature Range: -55℃~+155℃
R24 = 0805W8F1001T5E: Manufacturer: UNI-ROYAL(厚声); Add into BOM: yes; Tolerance: ±1%; Temperature Coefficient: ±100ppm/℃; Symbol: 0805W8F1001T5E; Device: 0805W8F1001T5E; LCSC Part Name: 1kΩ ±1% 125mW 厚膜电阻; Supplier Part: C17513; Manufacturer Part: 0805W8F1001T5E; Supplier Footprint: 0805; JLCPCB Part Class: Basic Part; Datasheet: https://atta.szlcsc.com/upload/public/pdf/source/20200306/C422600_1E6D84923E4A46A82E41ADD87F860B5C.pdf; Supplier: LCSC; Convert to PCB: yes; Type: Thick Film Resistors; Value: 1kΩ; Operating Temperature Range: -55℃~+155℃
R26 = 0402WGF2212TCE: Manufacturer: UNI-ROYAL(厚声); Add into BOM: yes; Tolerance: ±1%; Temperature Coefficient: ±100ppm/℃; Symbol: 0402WGF2212TCE; Device: 0402WGF2212TCE; LCSC Part Name: 22.1kΩ ±1% 62.5mW 厚膜电阻; Supplier Part: C43473; Manufacturer Part: 0402WGF2212TCE; Supplier Footprint: 0402; JLCPCB Part Class: Extended Part; Datasheet: https://atta.szlcsc.com/upload/public/pdf/source/20200306/C422600_1E6D84923E4A46A82E41ADD87F860B5C.pdf; Supplier: LCSC; Convert to PCB: yes; Type: Thick Film Resistors; Value: 22.1kΩ; Operating Temperature Range: -55℃~+155℃
SW3-SW6 = KH-6X6X16H-TJ: Manufacturer: kinghelm(金航标); Add into BOM: yes; Circuit: SPST; Actuator Style: Round Button; Operating Force: 260gf; Switch Length: 6mm; Switch Height: 16mm; Strike Gundam: 不带; Contact Current: 50mA; Voltage Rating (DC): 12V; Insulation Resistance: 100MΩ; Actuator/Cap Color: Black; Pin Style: PCPin; Symbol: KH-6X6X16H-TJ; Device: KH-6X6X16H-TJ; Supplier: LCSC; Supplier Part: C2837526; Manufacturer Part: KH-6X6X16H-TJ; JLCPCB Part Class: Extended Part; LCSC Part Name: 6*6*16mm 直插 轻触开关; Supplier Footprint: 插件; Datasheet: https://atta.szlcsc.com/upload/public/pdf/source/20210608/C2837526_67C82DD049E4739FDD12446EBFE20E5F.pdf; Convert to PCB: yes; Mounting Style: Straight; Switch Width: 6mm; Mechanical Life: -; Operating Temperature: -25℃~+70℃
SW7 = XKB5858-Z-E: Manufacturer: XKB Connection(中国星坤); Add into BOM: yes; Self Lock / No Lock: LATCHING; Actuator Style: Square Plunger; Contact Current: 100mA; Voltage Rating (AC): 250V; Voltage Rating (DC): 30V; Insulation Resistance: 100MΩ; Actuator/Cap Color: White; With Lamp: Without; Pin Style: PCPin; Operating Force: 250gf; Mechanical Life: 100000 Times; Symbol: XKB5858-Z-E; Device: XKB5858-Z-E; LCSC Part Name: XKB5858-Z-E; Supplier Part: C780038; Manufacturer Part: XKB5858-Z-E; Supplier Footprint: 插件; JLCPCB Part Class: Extended Part; Datasheet: https://atta.szlcsc.com/upload/public/pdf/source/20211011/56D3FA9FC185EAC41365C3B37B684CC1.pdf; Supplier: LCSC; Convert to PCB: yes; Mounting Style: Horizontal Plug; Operating Temperature: -15℃~+55℃
U3 = HUSB238_002DD: Manufacturer: Hynetek(慧能泰); Add into BOM: yes; Symbol: HUSB238_002DD; Device: HUSB238_002DD; LCSC Part Name: HUSB238_002DD; Supplier Part: C7471904; Manufacturer Part: HUSB238_002DD; Supplier Footprint: DFN-10L(3x3); JLCPCB Part Class: Extended Part; Datasheet: https://atta.szlcsc.com/upload/public/pdf/source/20240407/14E2BCB22C39B22B34E48E1B6FC2FE3E.pdf; Supplier: LCSC; Convert to PCB: yes
U5 U6 = PM254-1-19-Z-8.5: Manufacturer: HCTL(华灿天禄); Add into BOM: yes; Holes Structure: 1x19P; Pitch: 2.54mm; Circular Hole / Square Hole: Square Holes; Number of Holes: 19P; Current Rating (Max): 3A; Holes Direction: Top; Soldering Temperature(Max): 260℃@5S; Symbol: PM254-1-19-Z-8.5; Device: PM254-1-19-Z-8.5; LCSC Part Name: 1x19P 间距:2.54mm 直插; Supplier Part: C2897382; Manufacturer Part: PM254-1-19-Z-8.5; Supplier Footprint: 插件,P=2.54mm; JLCPCB Part Class: Extended Part; Datasheet: https://atta.szlcsc.com/upload/public/pdf/source/20230609/534BE42964C679BDE98E061007C4ABD6.pdf; Supplier: LCSC; Convert to PCB: yes; Row Spacing: -; Mounting Type: Straight; Number of Rows: Plugin; Voltage Rating (Max): -; Insulation Height: 8.5mm; Contact Material: Copper Alloy; Operating Temperature Range: -40℃~+105℃
U9 U10 U23 = YJD45G10AQ_C2942677: Manufacturer: YANGJIE(扬杰); Add into BOM: yes; Symbol: YJD45G10AQ_C2942677; Device: YJD45G10AQ_C2942677; LCSC Part Name: 车规级; Supplier Part: C2942677; Manufacturer Part: YJD45G10AQ; Supplier Footprint: TO-252; JLCPCB Part Class: Extended Part; Datasheet: https://atta.szlcsc.com/upload/public/pdf/source/20220614/EBA5EEDB9E1B0FCCC7AB0B980BC6DA5A.pdf; Supplier: LCSC; Convert to PCB: yes
U12 = HY2120-LB: Manufacturer: HYCON(宏康); Add into BOM: yes; Symbol: HY2120-LB; Device: HY2120-LB; LCSC Part Name: HY2120-LB; Supplier Part: C168778; Manufacturer Part: HY2120-LB; Supplier Footprint: SOT-23-6; JLCPCB Part Class: Extended Part; Datasheet: https://atta.szlcsc.com/upload/public/pdf/source/20180104/C168785_15150385461851227384.pdf; Supplier: LCSC; Convert to PCB: yes
U13 U14 = HY2213-BB3A: Manufacturer: HYCON(宏康); Add into BOM: yes; Symbol: HY2213-BB3A; Device: HY2213-BB3A; LCSC Part Name: HY2213-BB3A; Supplier Part: C113632; Manufacturer Part: HY2213-BB3A; Supplier Footprint: SOT-23-6; JLCPCB Part Class: Extended Part; Datasheet: https://atta.szlcsc.com/upload/public/pdf/source/20170531/1496195338580.pdf; Supplier: LCSC; Convert to PCB: yes
U15 = MAX17048G+T10: Manufacturer: ADI(亚德诺)/MAXIM(美信); Add into BOM: yes; The Chip Type: 电池监测芯片; Type of Battery: 锂离子/Polymer; Number of Cells: 1; Symbol: MAX17048G+T10; Device: MAX17048G+T10; LCSC Part Name: MAX17048G+T10; Supplier Part: C2682616; Manufacturer Part: MAX17048G+T10; Supplier Footprint: DFN-8-EP(2x2); JLCPCB Part Class: Extended Part; Datasheet: https://atta.szlcsc.com/upload/public/pdf/source/20210106/C2682616_818568B5D3BA4B627110FCAA33E0BFB1.pdf; Supplier: LCSC; Convert to PCB: yes; Operating Temperature: -20℃~+70℃
U18 = BQ25306RTER: Manufacturer: TI(德州仪器); Add into BOM: yes; Supply Voltage: 17V; Maximum Charge Current: 3A; Type of Battery: 锂离子/Polymer; Number of Cells: 2; Symbol: BQ25306RTER; Device: BQ25306RTER; Supplier: LCSC; Supplier Part: C3682611; Manufacturer Part: BQ25306RTER; JLCPCB Part Class: Extended Part; LCSC Part Name: BQ25306RTER; Supplier Footprint: WQFN-16(3x3); Datasheet: http://www.ti.com/cn/lit/gpn/bq25306; Convert to PCB: yes; Operating Temperature: -40℃~+85℃
U19 = LMR51430XFDDCR: Manufacturer: TI(德州仪器); Add into BOM: yes; Input Voltage: 4.5V~36V; Output Voltage: 600mV~34.2V; Output Current (Max): 3A; Switching Frequency: 1.1MHz; Quiescent Current (Iq): 40uA; Switch tube (built-in/external): 内置; Symbol: LMR51430XFDDCR; Device: LMR51430XFDDCR; LCSC Part Name: LMR51430XFDDCR; Supplier Part: C5219260; Manufacturer Part: LMR51430XFDDCR; Supplier Footprint: SOT-23-6-THIN(DDC); JLCPCB Part Class: Extended Part; Datasheet: https://www.ti.com/cn/lit/gpn/lmr51430; Supplier: LCSC; Convert to PCB: yes; Operating Temperature: -40℃~+150℃
U21 = BNO086: Manufacturer: CEVA; Add into BOM: yes; Symbol: BNO086; Device: BNO086; LCSC Part Name: BNO086; Supplier Part: C5264422; Manufacturer Part: BNO086; Supplier Footprint: TFLGA-28; JLCPCB Part Class: Extended Part; Datasheet: https://atta.szlcsc.com/upload/public/pdf/source/20240415/44FC701F4FB8EB2E8EF4F9E45B4206E6.pdf; Supplier: Mouser; Convert to PCB: yes
U22 = MAX98306ETD+T: Manufacturer: ADI(亚德诺)/MAXIM(美信); Add into BOM: yes; Type of Power Amplifier: D类功放; Speaker Channels: 双声道; Supply Voltage: 2.6V~5.5V; Symbol: MAX98306ETD+T; Device: MAX98306ETD+T; LCSC Part Name: 3.7W立体声D类音频功率放大器; Supplier Part: C124549; Manufacturer Part: MAX98306ETD+T; Supplier Footprint: TDFN-14-EP(3x3); JLCPCB Part Class: Extended Part; Datasheet: https://atta.szlcsc.com/upload/public/pdf/source/20170810/C124549_1502335289197879845.pdf; Supplier: LCSC; Convert to PCB: yes; Operating Temperature: -40℃~+85℃
USBC1 = TYPE-C-31-M-12: Manufacturer: 韩国韩荣; Add into BOM: yes; Connector Type: Type-C; Gender: Female; Number of Ports: 1; Number of Contacts: 16P; Current Rating - Power (Max): 5A; Symbol: TYPE-C-31-M-12; Device: TYPE-C-31-M-12; LCSC Part Name: Type-C 母; Supplier Part: C165948; Manufacturer Part: TYPE-C-31-M-12; Supplier Footprint: SMD; JLCPCB Part Class: Extended Part; Datasheet: https://atta.szlcsc.com/upload/public/pdf/source/20220525/466408E853115E789EDB0DDC29077C05.pdf; Supplier: LCSC; Convert to PCB: yes; Standard: -; Mounting Style: -; Contact Material: -; Contact Plating: -; Operating Temperature Range: -; Soldering Temperature(Max): -
VR1 VR2 = RKJXV122400R: Manufacturer: ALPSALPINE(阿尔卑斯阿尔派); Add into BOM: yes; Value: 10kΩ; Tolerance: ±5%; Rated Voltage: 5V; Power(Watts): 125mW; Symbol: RKJXV122400R; Device: RKJXV122400R; LCSC Part Name: 10kΩ ±5%; Supplier Part: C918854; Manufacturer Part: RKJXV122400R; Supplier Footprint: 插件; JLCPCB Part Class: Extended Part; Datasheet: https://atta.szlcsc.com/upload/public/pdf/source/20201117/C918854_AB501B8475748C966C0BA48728F1CF03.pdf; Supplier: LCSC; Convert to PCB: yes; Turns: -